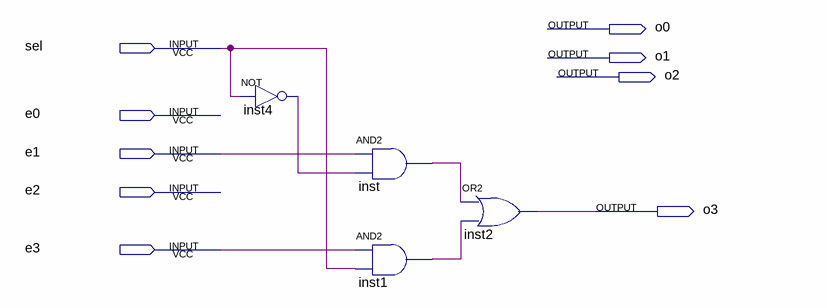
[diagram p0: schematic sheet]
// Quartus schematic mux_2_1.bdf as structural Verilog: 4 symbols, 9 pins
module mux_2_1 (
  input  sel,
  input  e0,
  input  e1,
  input  e2,
  input  e3,
  output o0,
  output o1,
  output o2,
  output o3
);

  wire inst1_out, inst4_out, inst_out;

  not inst4 (inst4_out, sel);
  and inst (inst_out, e1, inst4_out);
  and inst1 (inst1_out, e3, sel);
  or inst2 (o3, inst_out, inst1_out);
endmodule
